# Altium schematic sheet sensor_zigbee_schematic.SchDoc
size A
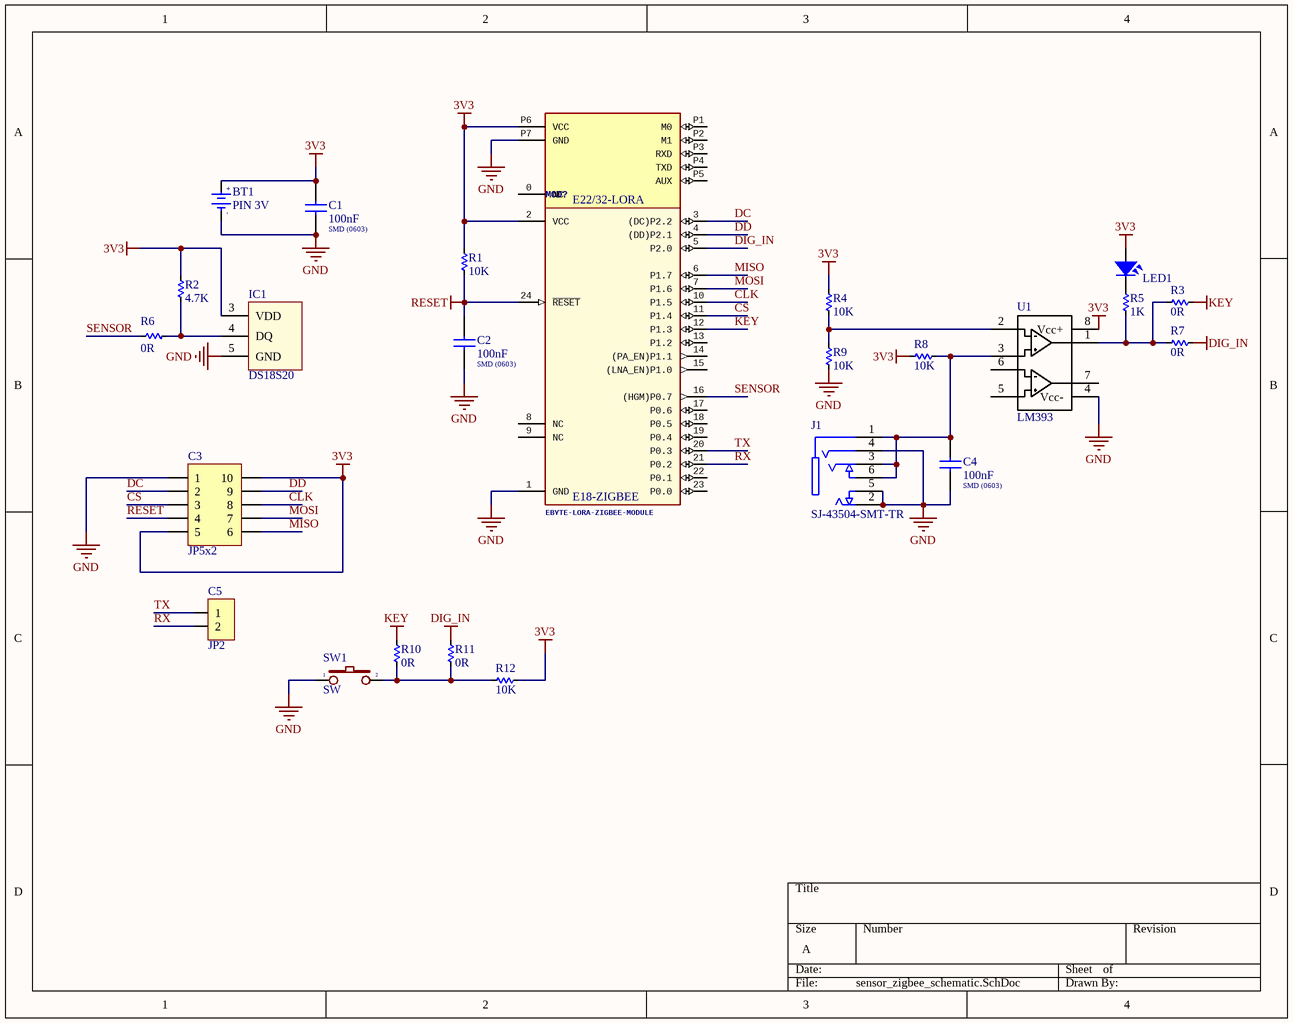
[diagram p0: sensor_zigbee_schematic.SchDoc]

## Parts
BT1  PIN 3V  [PIN3V]
C1  Valor: 100nF  Encapsulamento: SMD (0603)  [CAP_0603]  (hidden comment: Capacitor SMD)
C2  Valor: 100nF  Encapsulamento: SMD (0603)  [CAP_0603]  (hidden comment: Capacitor SMD)
C3  JP5x2  [JP5-D2T]
C4  Valor: 100nF  Encapsulamento: SMD (0603)  [CAP_0603]  (hidden comment: Capacitor SMD)
C5  JP2  [JP2-D1T]
IC1  DS18S20  [DS18S20]
J1  SJ-43504-SMT-TR  [CUI_SJ-43504-SMT-TR]
LED1  LED  [LED-0805-Blue]  (value not drawn)
MOD?  EBYTE-LORA-ZIGBEE-MODULE  [EBYTE-LORA-ZIGBEE-MODULE]
R1  10K  [RES-SMD-0603]
R2  4.7K  [RES-SMD-0603]
R3  0R  [RES-SMD-0603]
R4  10K  [RES-SMD-0603]
R5  1K  [RES-SMD-0603]
R6  0R  [RES-SMD-0603]
R7  0R  [RES-SMD-0603]
R8  10K  [RES-SMD-0603]
R9  10K  [RES-SMD-0603]
R10  0R  [RES-SMD-0603]
R11  0R  [RES-SMD-0603]
R12  10K  [RES-SMD-0603]
SW1  SW  [SW1-DIP]
U1  LM393  [SO8]

## Nets
3V3: BT1.1(+3V) C1.2 C3.5 C3.10 IC1.3(VDD) LED1.1 MOD?.2(VCC) MOD?.P6(VCC) R1.1 R2.2 R4.1 R8.1 R12.2 U1.8(Vcc+)
DIG_IN: MOD?.5(P2.0) R7.2 R11.2
GND: BT1.2(GND) C1.1 C2.1 C3.1 C4.1 IC1.5(GND) J1.2(TIP) J1.4(RING2) J1.5(TIP_SWITCH) MOD?.1(GND) MOD?.P7(GND) R9.2 SW1.1 U1.4(Vcc-)
KEY: MOD?.12(P1.3) R3.1 R10.2
RESET: C2.2 C3.4 MOD?.24(~{RESET}) R1.2
CLK: C3.8 MOD?.10(P1.5)
CS: C3.3 MOD?.11(P1.4)
DC: C3.2 MOD?.3((DC)P2.2)
DD: C3.9 MOD?.4((DD)P2.1)
MISO: C3.6 MOD?.6(P1.7)
MOSI: C3.7 MOD?.7(P1.6)
RX: C5.2 MOD?.21(P0.2)
SENSOR: MOD?.16((HGM)P0.7) R6.1
TX: C5.1 MOD?.20(P0.3)
NetC4_2: C4.2 J1.1(SLEEVE) J1.3(RING1) J1.6(RING1_SWITCH) R8.2 U1.3
NetIC1_4: IC1.4(DQ) R2.1 R6.2
NetLED1_2: LED1.2 R5.2
NetR3_2: R3.2 R5.1 R7.1 U1.1
NetR4_2: R4.2 R9.1 U1.2
NetR10_1: R10.1 R11.1 R12.1 SW1.2

Not connected (* = marked no-connect by the designer): MOD? 0(NC) 8(NC) 9(NC) 13(P1.2) 14((PA_EN)P1.1) 15((LNA_EN)P1.0) 17(P0.6) 18(P0.5) 19(P0.4) 22(P0.1) 23(P0.0) P1(M0) P2(M1) P3(RXD) P4(TXD) P5(AUX); U1 5 6 7

## Notes on the sheet
- (in symbol EBYTE-LORA-ZIGBEE-MODULE) E22/32-LORA; E18-ZIGBEE
- (in symbol PIN 3V) +; -

## Library data of the parts
BT1 = PIN 3V: Battery 3VDC; Value: PIN 3V
C3 = JP5x2: WR-PHD 2.54 mm Dual Socket Header; Manufacturer: W¨¹rth Elektronik eiSos GmbH; partNo: 61301021821; ComponentLink1 Description: Manufacturer; ComponentLink2 Description: Datasheet; NoPins: 10; Created Date: 29 March 2013; ComponentLink1URL: http://www.we-online.com; ComponentLink2URL: http://katalog.we-online.de/em/datasheet/6130xx21821.pdf; Created by: Karrer Zheng
C5 = JP2: WR-PHD 2.54 mm Angled Socket Header; Manufacturer: W¨¹rth Elektronik eiSos GmbH; partNo: 613002143121; ComponentLink1 Description: Manufacturer; ComponentLink2 Description: Datasheet; NoPins: 02; Created Date: 29 March 2013; ComponentLink1URL: http://www.we-online.com; ComponentLink2URL: http://katalog.we-online.de/em/datasheet/6130xx143121.pdf; Created by: Karrer Zheng
IC1 = DS18S20: High Precision  1-Wire® Digital Thermometer
J1 = SJ-43504-SMT-TR: 3.5 mm, 4 Conductors, Right Angle, Mid Mount _SMT_, Dual Switches, Shielded, Audio Jack Connector; MF: CUI Devices; Availability: Unavailable; SnapEDA_Link: https://www.snapeda.com/parts/SJ-43504-SMT-TR/CUI%20Devices/view-part/303279/?ref=snap; MP: SJ-43504-SMT-TR; Price: None; Value: *; Package: None
LED1 = LED SMD: Value: LED 3 - 5 ly 2 Colour
MOD? = EBYTE-LORA-ZIGBEE-MODULE: GateName_1: G$1; SymbolName_1: EBYTE-E18-MS1PA1; LibraryName: ok-modules-dev; DeviceSetName: EBYTE-E18-MS1PA1
R1-R12 = Res-SMD: Resistor; Manufacturer: Generic Components; Class: Passive; Published: 08/06/2000; Publisher: Altium Hobart Technology Centre
SW1 = SW2: Switch button 2 pin; Value: SW chip 2 pin
U1 = LM393: IC DUAL COMPARATOR
C1 C2 C4 = Capacitor SMD: Descrição: Capacitor SMD; Marca: *; Modelo: *; Observação: *